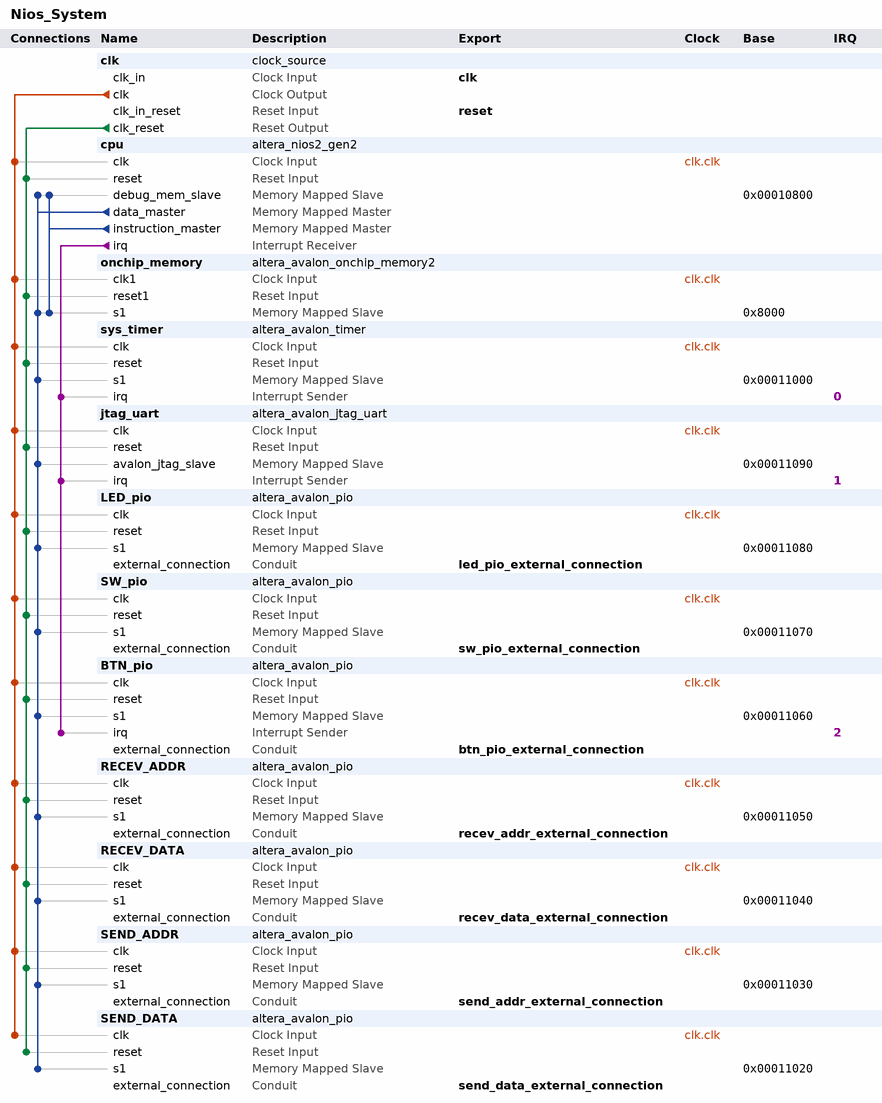
[diagram p0: system contents]
# Platform Designer (Qsys) system Nios_System, Cyclone V 5CSEMA5F31C6
# Parameters at their usual value, and those the tool derives, are not listed.
package require -exact qsys 18.1
create_system Nios_System
set_project_property DEVICE_FAMILY {Cyclone V}
set_project_property DEVICE 5CSEMA5F31C6

add_instance clk clock_source 18.1
set_instance_parameter_value clk clockFrequency 50000000

add_instance cpu altera_nios2_gen2 18.1
set_instance_parameter_value cpu cpuID 1
set_instance_parameter_value cpu dcache_size 2048
set_instance_parameter_value cpu exceptionSlave onchip_memory.s1
set_instance_parameter_value cpu icache_size 4096
set_instance_parameter_value cpu impl Fast
set_instance_parameter_value cpu resetSlave onchip_memory.s1

add_instance onchip_memory altera_avalon_onchip_memory2 18.1
set_instance_parameter_value onchip_memory dataWidth 32
set_instance_parameter_value onchip_memory dualPort false
set_instance_parameter_value onchip_memory initMemContent true
set_instance_parameter_value onchip_memory initializationFileName onchip_mem.hex
set_instance_parameter_value onchip_memory memorySize 20480

add_instance sys_timer altera_avalon_timer 18.1
set_instance_parameter_value sys_timer period 1
set_instance_parameter_value sys_timer periodUnits MSEC

add_instance jtag_uart altera_avalon_jtag_uart 18.1
set_instance_parameter_value jtag_uart simInteractiveOptions NO_INTERACTIVE_WINDOWS

add_instance LED_pio altera_avalon_pio 18.1
set_instance_parameter_value LED_pio direction Output
set_instance_parameter_value LED_pio width 10

add_instance SW_pio altera_avalon_pio 18.1
set_instance_parameter_value SW_pio direction Input
set_instance_parameter_value SW_pio width 10

add_instance BTN_pio altera_avalon_pio 18.1
set_instance_parameter_value BTN_pio captureEdge true
set_instance_parameter_value BTN_pio direction Input
set_instance_parameter_value BTN_pio edgeType FALLING
set_instance_parameter_value BTN_pio generateIRQ true
set_instance_parameter_value BTN_pio irqType EDGE
set_instance_parameter_value BTN_pio width 3

add_instance RECEV_ADDR altera_avalon_pio 18.1
set_instance_parameter_value RECEV_ADDR direction Input
set_instance_parameter_value RECEV_ADDR width 8

add_instance RECEV_DATA altera_avalon_pio 18.1
set_instance_parameter_value RECEV_DATA direction Input
set_instance_parameter_value RECEV_DATA width 32

add_instance SEND_ADDR altera_avalon_pio 18.1
set_instance_parameter_value SEND_ADDR direction Output
set_instance_parameter_value SEND_ADDR width 8

add_instance SEND_DATA altera_avalon_pio 18.1
set_instance_parameter_value SEND_DATA direction Output
set_instance_parameter_value SEND_DATA width 32

# connections
add_connection clk.clk BTN_pio.clk clock
add_connection clk.clk cpu.clk clock
add_connection clk.clk jtag_uart.clk clock
add_connection clk.clk LED_pio.clk clock
add_connection clk.clk onchip_memory.clk1 clock
add_connection clk.clk RECEV_ADDR.clk clock
add_connection clk.clk RECEV_DATA.clk clock
add_connection clk.clk SEND_ADDR.clk clock
add_connection clk.clk SEND_DATA.clk clock
add_connection clk.clk SW_pio.clk clock
add_connection clk.clk sys_timer.clk clock
add_connection clk.clk_reset BTN_pio.reset reset
add_connection clk.clk_reset cpu.reset reset
add_connection clk.clk_reset jtag_uart.reset reset
add_connection clk.clk_reset LED_pio.reset reset
add_connection clk.clk_reset onchip_memory.reset1 reset
add_connection clk.clk_reset RECEV_ADDR.reset reset
add_connection clk.clk_reset RECEV_DATA.reset reset
add_connection clk.clk_reset SEND_ADDR.reset reset
add_connection clk.clk_reset SEND_DATA.reset reset
add_connection clk.clk_reset SW_pio.reset reset
add_connection clk.clk_reset sys_timer.reset reset
add_connection cpu.data_master BTN_pio.s1 avalon
set_connection_parameter_value cpu.data_master/BTN_pio.s1 baseAddress 0x00011060
add_connection cpu.data_master cpu.debug_mem_slave avalon
set_connection_parameter_value cpu.data_master/cpu.debug_mem_slave baseAddress 0x00010800
add_connection cpu.data_master jtag_uart.avalon_jtag_slave avalon
set_connection_parameter_value cpu.data_master/jtag_uart.avalon_jtag_slave baseAddress 0x00011090
add_connection cpu.data_master LED_pio.s1 avalon
set_connection_parameter_value cpu.data_master/LED_pio.s1 baseAddress 0x00011080
add_connection cpu.data_master onchip_memory.s1 avalon
set_connection_parameter_value cpu.data_master/onchip_memory.s1 baseAddress 0x8000
add_connection cpu.data_master RECEV_ADDR.s1 avalon
set_connection_parameter_value cpu.data_master/RECEV_ADDR.s1 baseAddress 0x00011050
add_connection cpu.data_master RECEV_DATA.s1 avalon
set_connection_parameter_value cpu.data_master/RECEV_DATA.s1 baseAddress 0x00011040
add_connection cpu.data_master SEND_ADDR.s1 avalon
set_connection_parameter_value cpu.data_master/SEND_ADDR.s1 baseAddress 0x00011030
add_connection cpu.data_master SEND_DATA.s1 avalon
set_connection_parameter_value cpu.data_master/SEND_DATA.s1 baseAddress 0x00011020
add_connection cpu.data_master SW_pio.s1 avalon
set_connection_parameter_value cpu.data_master/SW_pio.s1 baseAddress 0x00011070
add_connection cpu.data_master sys_timer.s1 avalon
set_connection_parameter_value cpu.data_master/sys_timer.s1 baseAddress 0x00011000
add_connection cpu.instruction_master cpu.debug_mem_slave avalon
set_connection_parameter_value cpu.instruction_master/cpu.debug_mem_slave baseAddress 0x00010800
add_connection cpu.instruction_master onchip_memory.s1 avalon
set_connection_parameter_value cpu.instruction_master/onchip_memory.s1 baseAddress 0x8000
add_connection cpu.irq BTN_pio.irq interrupt
set_connection_parameter_value cpu.irq/BTN_pio.irq irqNumber 2
add_connection cpu.irq jtag_uart.irq interrupt
set_connection_parameter_value cpu.irq/jtag_uart.irq irqNumber 1
add_connection cpu.irq sys_timer.irq interrupt
set_connection_parameter_value cpu.irq/sys_timer.irq irqNumber 0

# exported interfaces
add_interface btn_pio_external_connection conduit end
set_interface_property btn_pio_external_connection EXPORT_OF BTN_pio.external_connection
add_interface clk clock sink
set_interface_property clk EXPORT_OF clk.clk_in
add_interface led_pio_external_connection conduit end
set_interface_property led_pio_external_connection EXPORT_OF LED_pio.external_connection
add_interface recev_addr_external_connection conduit end
set_interface_property recev_addr_external_connection EXPORT_OF RECEV_ADDR.external_connection
add_interface recev_data_external_connection conduit end
set_interface_property recev_data_external_connection EXPORT_OF RECEV_DATA.external_connection
add_interface reset reset sink
set_interface_property reset EXPORT_OF clk.clk_in_reset
add_interface send_addr_external_connection conduit end
set_interface_property send_addr_external_connection EXPORT_OF SEND_ADDR.external_connection
add_interface send_data_external_connection conduit end
set_interface_property send_data_external_connection EXPORT_OF SEND_DATA.external_connection
add_interface sw_pio_external_connection conduit end
set_interface_property sw_pio_external_connection EXPORT_OF SW_pio.external_connection

set_interconnect_requirement {$system} qsys_mm.clockCrossingAdapter HANDSHAKE
set_interconnect_requirement {$system} qsys_mm.enableEccProtection FALSE
set_interconnect_requirement {$system} qsys_mm.insertDefaultSlave FALSE
set_interconnect_requirement {$system} qsys_mm.maxAdditionalLatency 1

save_system Nios_System.qsys
